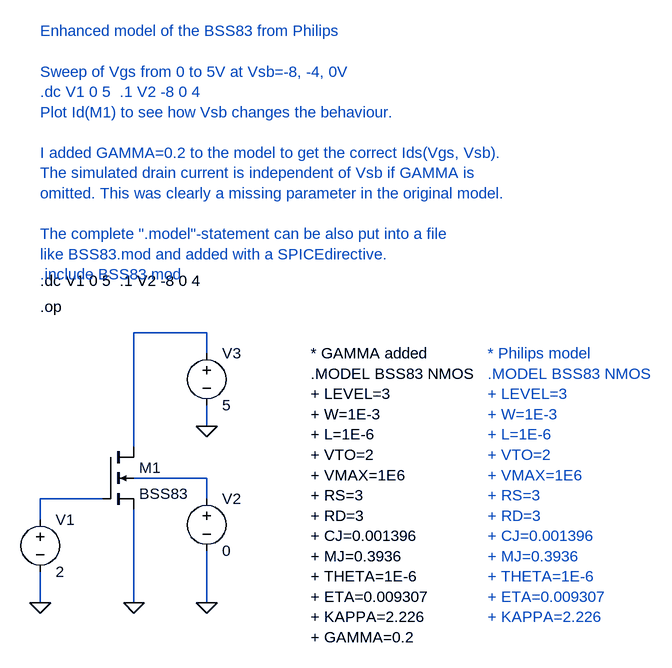
[diagram p0: schematic bss83.asc]
bss83.asc, the LTspice schematic file:
Version 4
SHEET 1 1088 680
WIRE 32 256 32 224
WIRE 32 384 32 336
WIRE 128 224 32 224
WIRE 176 144 176 -32
WIRE 176 384 176 240
WIRE 288 -32 176 -32
WIRE 288 0 288 -32
WIRE 288 112 288 80
WIRE 288 192 176 192
WIRE 288 224 288 192
WIRE 288 384 288 304
FLAG 288 112 0
FLAG 288 384 0
FLAG 32 384 0
FLAG 176 384 0
SYMBOL nmos4 128 144 R0
SYMATTR InstName M1
SYMATTR Value BSS83
SYMBOL voltage 288 208 R0
SYMATTR InstName V2
SYMATTR Value 0
SYMBOL voltage 288 -16 R0
SYMATTR InstName V3
SYMATTR Value 5
SYMBOL voltage 32 240 R0
SYMATTR InstName V1
SYMATTR Value 2
TEXT 448 0 Left 0 !* GAMMA added\n.MODEL BSS83 NMOS\n+ LEVEL=3\n+ W=1E-3\n+ L=1E-6\n+ VTO=2\n+ VMAX=1E6\n+ RS=3\n+ RD=3\n+ CJ=0.001396\n+ MJ=0.3936\n+ THETA=1E-6\n+ ETA=0.009307\n+ KAPPA=2.226\n+ GAMMA=0.2
TEXT 32 -112 Left 0 !.dc V1 0 5  .1 V2 -8 0 4
TEXT 32 -72 Left 0 !.op
TEXT 32 -496 Left 0 ;Enhanced model of the BSS83 from Philips\n \nSweep of Vgs from 0 to 5V at Vsb=-8, -4, 0V\n.dc V1 0 5  .1 V2 -8 0 4\nPlot Id(M1) to see how Vsb changes the behaviour.\n \nI added GAMMA=0.2 to the model to get the correct Ids(Vgs, Vsb).\nThe simulated drain current is independent of Vsb if GAMMA is \nomitted. This was clearly a missing parameter in the original model.\n \nThe complete ".model"-statement can be also put into a file \nlike BSS83.mod and added with a SPICEdirective.\n.include BSS83.mod
TEXT 720 0 Left 0 ;* Philips model\n.MODEL BSS83 NMOS\n+ LEVEL=3\n+ W=1E-3\n+ L=1E-6\n+ VTO=2\n+ VMAX=1E6\n+ RS=3\n+ RD=3\n+ CJ=0.001396\n+ MJ=0.3936\n+ THETA=1E-6\n+ ETA=0.009307\n+ KAPPA=2.226

The netlist it stands for:
* bss83.asc
M1 N002 N001 0 N003 BSS83
V2 N003 0 0
V3 N002 0 5
V1 N001 0 2
.model NMOS NMOS
.model PMOS PMOS
.lib standard.mos
* GAMMA added
.MODEL BSS83 NMOS
+ LEVEL=3
+ W=1E-3
+ L=1E-6
+ VTO=2
+ VMAX=1E6
+ RS=3
+ RD=3
+ CJ=0.001396
+ MJ=0.3936
+ THETA=1E-6
+ ETA=0.009307
+ KAPPA=2.226
+ GAMMA=0.2
.dc V1 0 5  .1 V2 -8 0 4
.op
* Enhanced model of the BSS83 from Philips
* Sweep of Vgs from 0 to 5V at Vsb=-8, -4, 0V
* .dc V1 0 5  .1 V2 -8 0 4
* Plot Id(M1) to see how Vsb changes the behaviour.
* I added GAMMA=0.2 to the model to get the correct Ids(Vgs, Vsb).
* The simulated drain current is independent of Vsb if GAMMA is
* omitted. This was clearly a missing parameter in the original model.
* The complete ".model"-statement can be also put into a file
* like BSS83.mod and added with a SPICEdirective.
* .include BSS83.mod
* * Philips model
* .MODEL BSS83 NMOS
* + LEVEL=3
* + W=1E-3
* + L=1E-6
* + VTO=2
* + VMAX=1E6
* + RS=3
* + RD=3
* + CJ=0.001396
* + MJ=0.3936
* + THETA=1E-6
* + ETA=0.009307
* + KAPPA=2.226
.backanno
.end